# Altium schematic sheet RTC.SchDoc
size A4; DocumentNumber: 7; SheetNumber: 7; SheetTotal: 7
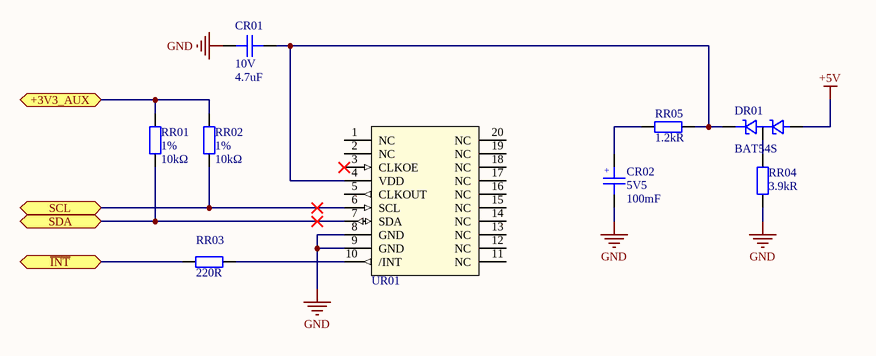
[diagram p0: RTC.SchDoc]

## Parts
CR01  Voltage Rating: 10V  Capacitance: 4.7uF  [0603C]  (hidden comment: CAP CER 4.7UF 10V X5R 0603)
CR02  Voltage Rating: 5V5  Capacitance: 100mF  [WCAP-ASLI_5x5.5]  (hidden comment: CAP ALUM 100 UF 20% 6.3 V SMD)
DR01  BAT54S
RR01  Tolerance: 1%  Resistance: 10kΩ  [R0603]  (hidden comment: 10 kOhms ±1% 0.1W, 1/10W Chip Resistor 0603 (1608 Metric)  Thick Film)
RR02  Tolerance: 1%  Resistance: 10kΩ  [R0603]  (hidden comment: 10 kOhms ±1% 0.1W, 1/10W Chip Resistor 0603 (1608 Metric)  Thick Film)
RR03  Resistance: 220R  [Resistor-0603]  (hidden comment: R 220Ω ±1% 0603 0.1W)
RR04  Resistance: 3.9kR  [Resistor-0603]  (hidden comment: R 3kΩ ±1% 0603 0.1W)
RR05  Resistance: 1.2kR  [R0402]  (hidden comment: RES SMD 1.2K OHM 1% 1/16W 0402)
UR01  IC RTC-8564JE RTC CLK/CALENDAR I2C 20-VSOJ  (value not drawn)

## Ports
+3V3_AUX, SCL, SDA, ~{INT}

## Nets
+5V: DR01.1
GND: CR01.2 CR02.2 RR04.2 UR01.8(GND) UR01.9(GND)
+3V3_AUX: RR01.2 RR02.2 ; port +3V3_AUX
~{INT}: RR03.1 ; port ~{INT}
SCL: RR02.1 UR01.6(SCL) ; port SCL
SDA: RR01.1 UR01.7(SDA) ; port SDA
NetCR01_1: CR01.1 DR01.2 RR05.1 UR01.4(VDD)
NetCR02_1: CR02.1 RR05.2
NetDR01_3: DR01.3 RR04.1
NetRR03_2: RR03.2 UR01.10(/INT)

Not connected (* = marked no-connect by the designer): UR01 1(NC) 2(NC) 3(CLKOE)* 5(CLKOUT) 11(NC) 12(NC) 13(NC) 14(NC) 15(NC) 16(NC) 17(NC) 18(NC) 19(NC) 20(NC)

## Notes on the sheet
- Title
- Size:
- Date:
- A4
- Number:
- Time:
- Revision:
- Sheet
- of
- File:
- (in symbol CAP ALUM 100 UF 20% 6.3 V SMD) +

## Library data of the parts
CR01 = CAP CER 4.7UF 10V X5R 0603: 4.7µF ±10% 10V Ceramic Capacitor X5R 0603 (1608 Metric); Manufacturer: Yageo; Manufacturer Part Number: CC0603KRX5R6BB475; Supplier 1: Digi-Key; Stock 1: 325858; Pricing 1: 1=0.26, 10=0.18, 100=0.102, 500=0.072, 1000=0.063 (USD); Mount: Surface Mount; Case Code (Imperial): 0603; Case Code (Metric): 1608; Min Operating Temperature: -55°C; Max Operating Temperature: 85°C; Voltage Rating (DC): 10V; Tolerance: 10%; Packaging: Tape and Reel; Package Quantity: 1; Dielectric: X5R; Termination: SMD/SMT; Composition: Ceramic; Length: 1.6mm; Height: 0.8mm; Width: 0.8mm; Thickness: 0.035inch; Depth: 0.8mm; Radiation Hardening: No; REACH SVHC: Unknown; Lead Free: Lead Free; Halogen Free: Halogen Free; ComponentLink1URL: http://www.farnell.com/datasheets/2167237.pdf?src-supplier=Element14; ComponentLink1Description: http://www.farnell.com/datasheets/2167237.pdf?src-supplier=Element14; ComponentLink2URL: http://www.yageo.com/documents/recent/UPY-GPHC_X5R_4V-to-50V_25.pdf?src-supplier=Digi-Key; ComponentLink2Description: http://www.yageo.com/documents/recent/UPY-GPHC_X5R_4V-to-50V_25.pdf?src-supplier=Digi-Key; ComponentLink3URL: http://www.yageo.com/documents/recent/UPY-GPHC_X5R_4V-to-50V_12.pdf?src-supplier=Avnet; ComponentLink3Description: http://www.yageo.com/documents/recent/UPY-GPHC_X5R_4V-to-50V_12.pdf?src-supplier=Avnet; ComponentLink4URL: http://www.yageo.com/documents/recent/UPY-GPHC_X5R_4V-to-50V_12.pdf?src-supplier=Avnet+Europe; ComponentLink4Description: http://www.yageo.com/documents/recent/UPY-GPHC_X5R_4V-to-50V_12.pdf?src-supplier=Avnet+Europe; Supplier Part Number 1: 311-1455-1-ND; Case/Package: 0603
CR02 = CAP ALUM 100 UF 20% 6.3 V SMD: 100µF 6.3V Aluminum Electrolytic Capacitors Radial, Can - SMD  2000 Hrs @ 105°C; Manufacturer Part Number: 865080142007; Manufacturer: Wurth Elektronik; Dissipation Factor: 24%; Endurance: 2000h; Leakage Current: 6.3uA; Ripple Current: 170mA; Capacitance Tolerance: +/-20%; Technical Reference: ASEC055101M6R3DVCTBB000; Polarity: Polar; Impedance: 800mR; Life (Hours): 2000Hour; ComponentLink1Description: Manufacturer; ComponentLink1URL: http://www.we-online.de; ComponentLink2Description: Datasheet; ComponentLink2URL: https://www.we-online.com/catalog/datasheet/865080142007.pdf; Height: 5.5mm; Mounting Technology: SMT; Operating Temperature: -55 to +105degC; Packaging: Tape and Reel; Published Date: May 2020; Diameter: 5mm; Supplier 1: Digi-Key; Stock 1: 2227; Pricing 1: 1=0.2, 50=0.167, 100=0.145, 250=0.129, 500=0.113 (USD); Mount: Surface Mount; Case/Package: Radial; Min Operating Temperature: -55°C; Max Operating Temperature: 105°C; Package Quantity: 1000; Ripple Current (AC): 170mA; Tolerance: 20%; Voltage Rating (DC): 6.3V; Height - Seated (Max): 0.217inch; REACH SVHC: Unknown; ComponentLink3URL: http://www.farnell.com/datasheets/1880090.pdf?src-supplier=Farnell; ComponentLink3Description: http://www.farnell.com/datasheets/1880090.pdf?src-supplier=Farnell; ComponentLink4URL: http://www.farnell.com/datasheets/1880090.pdf?src-supplier=Newark; ComponentLink4Description: http://www.farnell.com/datasheets/1880090.pdf?src-supplier=Newark; ComponentLink5URL: http://katalog.we-online.de/pbs/datasheet/865080142007.pdf?src-supplier=Digi-Key; ComponentLink5Description: http://katalog.we-online.de/pbs/datasheet/865080142007.pdf?src-supplier=Digi-Key; ComponentLink6URL: http://www.farnell.com/datasheets/1880090.pdf?src-supplier=Element14; ComponentLink6Description: http://www.farnell.com/datasheets/1880090.pdf?src-supplier=Element14; ComponentLink7URL: https://katalog.we-online.de/pbs/datasheet/865080142007.pdf?src-supplier=Digi-Key; ComponentLink7Description: https://katalog.we-online.de/pbs/datasheet/865080142007.pdf?src-supplier=Digi-Key; Supplier Part Number 1: 732-8472-1-ND
DR01 = BAT54S: Schottky DiodeS
RR01 RR02 = RES SMD 10K OHM 1% 1/10W 0603: Manufacturer: Yageo; Manufacturer Part Number: RC0603FR-0710KL; Temperature Coefficient: 100ppm/°C; Power Rating: 100mW; Voltage Rating: 75V; Voltage Rating (DC): 50V; Supplier 1: Digi-Key; Stock 1: 81498627; Pricing 1: 1=0.1, 10=0.024, 100=0.0097, 1000=0.0044, 2500=0.0038 (USD); Case Code (Imperial): 0603; Case Code (Metric): 1608; Min Operating Temperature: -55°C; Max Operating Temperature: 155°C; Composition: Thick Film; Packaging: Tape and Reel; Termination: SMD/SMT; Military Standard: Not; Length: 1.6mm; Height: 0.45mm; Depth: 0.8mm; REACH SVHC: No SVHC; Lead Free: Lead Free; ComponentLink1URL: http://www.farnell.com/datasheets/38590.pdf?src-supplier=Element14; ComponentLink1Description: http://www.farnell.com/datasheets/38590.pdf?src-supplier=Element14; ComponentLink2URL: https://www.verical.com/server-webapp/html/getDatasheet?partID=409289&src-supplier=Verical; ComponentLink2Description: https://www.verical.com/server-webapp/html/getDatasheet?partID=409289&src-supplier=Verical; ComponentLink3URL: http://www.farnell.com/datasheets/1868787.pdf?src-supplier=Element14; ComponentLink3Description: http://www.farnell.com/datasheets/1868787.pdf?src-supplier=Element14; ComponentLink4URL: http://www.farnell.com/datasheets/2167052.pdf?src-supplier=Element14; ComponentLink4Description: http://www.farnell.com/datasheets/2167052.pdf?src-supplier=Element14; ComponentLink5URL: http://www.farnell.com/datasheets/443971.pdf?src-supplier=Element14; ComponentLink5Description: http://www.farnell.com/datasheets/443971.pdf?src-supplier=Element14; Supplier Part Number 1: 311-10.0KHRCT-ND; Case/Package: 0603; Number of Pins: 2; Weight: 7.1E-05oz; Width: 0.8mm; Lead Pitch: 0.3mm
RR03 = R 220Ω ±1% 0603 0.1W: Resistor; Manufacturer: Stackpole Electronics; Manufacturer Part Number: RMCF0603FT220R; Power Rating: 100mW; Temperature Coefficient: 100ppm/°C; Supplier 1: Digi-Key; Stock 1: 79747; Pricing 1: 1=0.1, 10=0.016, 100=0.0065, 1000=0.0029, 2500=0.0025 (USD); Mount: Surface Mount; Case/Package: 0603; Case Code (Metric): 1608; Case Code (Imperial): 0603; Contact Plating: Tin,Matte; Min Operating Temperature: -55°C; Max Operating Temperature: 155°C; Packaging: Tape and Reel; Composition: Thick Film; Number of Terminations: 2; Max Power Dissipation: 100mW; Features: Automotive AEC-Q200; Length: 0.061inch; Height: 0.022inch; Width: 0.031inch; Radiation Hardening: No; Lead Free: Lead Free; ComponentLink1URL: http://components.arrow.com/part/dataview/50498833S229663N1174?src-supplier=Arrow; ComponentLink1Description: http://components.arrow.com/part/dataview/50498833S229663N1174?src-supplier=Arrow; ComponentLink2URL: https://www.seielect.com/catalog/SEI-Packaging.pdf?src-supplier=Digi-Key; ComponentLink2Description: https://www.seielect.com/catalog/SEI-Packaging.pdf?src-supplier=Digi-Key; ComponentLink3URL: http://www.seielect.com/Catalog/SEI-RMC.pdf?src-supplier=Future+Electronics; ComponentLink3Description: http://www.seielect.com/Catalog/SEI-RMC.pdf?src-supplier=Future+Electronics; ComponentLink4URL: https://www.seielect.com/catalog/SEI-RMCF_RMCP.pdf?src-supplier=Avnet; ComponentLink4Description: https://www.seielect.com/catalog/SEI-RMCF_RMCP.pdf?src-supplier=Avnet; Supplier Part Number 1: RMCF0603FT220RCT-ND; Tolerance: 1%
RR04 = R 3kΩ ±1% 0603 0.1W: Resistor; Manufacturer: Yageo; Manufacturer Part Number: RC0603FR-073KL; Temperature Coefficient: 100ppm/°C; Power Rating: 100mW; Voltage Rating: 50V; Supplier 1: Digi-Key; Stock 1: 3150938; Pricing 1: 1=0.1, 10=0.024, 100=0.0097, 1000=0.0044, 2500=0.0038 (USD); Case/Package: 0603; Number of Pins: 2; Case Code (Imperial): 0603; Case Code (Metric): 1608; Min Operating Temperature: -55°C; Max Operating Temperature: 155°C; Packaging: Tape and Reel; Composition: Thick Film; Termination: SMD/SMT; Voltage Rating (DC): 50V; Military Standard: Not; Length: 1.6mm; Width: 800um; Depth: 0.8mm; Lead Free: Lead Free; REACH SVHC: No SVHC; Supplier Part Number 1: 311-3.00KHRCT-ND; Tolerance: 1%
RR05 = RES SMD 1.2K OHM 1% 1/16W 0402: 1.2 kOhms ±1% 0.063W, 1/16W Chip Resistor 0402 (1005 Metric) Moisture Resistant Thick Film; Manufacturer: Yageo; Manufacturer Part Number: RC0402FR-071K2L; Power Rating: 63mW; Voltage Rating: 50V; Temperature Coefficient: 100ppm/°C; Supplier 1: Digi-Key; Stock 1: 894472; Pricing 1: 1=0.1, 10=0.015, 100=0.0062, 1000=0.0028, 2500=0.0024, 5000=0.002 (USD); Case/Package: 0402; Case Code (Imperial): 0402; Case Code (Metric): 1005; Min Operating Temperature: -55°C; Max Operating Temperature: 155°C; Packaging: Tape and Reel; Package Quantity: 1; Termination: SMD/SMT; Composition: Thick Film; Number of Terminations: 2; Military Standard: Not; Max Power Dissipation: 63mW; Features: Moisture Resistant; Length: 1mm; Height: 0.016inch; Width: 0.02inch; Depth: 0.5mm; REACH SVHC: Unknown; Lead Free: Lead Free; ComponentLink1URL: http://www.farnell.com/datasheets/2167052.pdf?src-supplier=Element14; ComponentLink1Description: http://www.farnell.com/datasheets/2167052.pdf?src-supplier=Element14; ComponentLink2URL: https://www.verical.com/server-webapp/html/getDatasheet?partID=323716&src-supplier=Verical; ComponentLink2Description: https://www.verical.com/server-webapp/html/getDatasheet?partID=323716&src-supplier=Verical; ComponentLink3URL: http://documents.rs-components.com/techlib://itc_doclist_GB.htm?stockno=6186138&src-supplier=RSComponents; ComponentLink3Description: http://documents.rs-components.com/techlib://itc_doclist_GB.htm?stockno=6186138&src-supplier=RSComponents; ComponentLink4URL: http://www.yageo.com/documents/recent/PYu-RC_Group_51_RoHS_L_10.pdf?src-supplier=Digi-Key; ComponentLink4Description: http://www.yageo.com/documents/recent/PYu-RC_Group_51_RoHS_L_10.pdf?src-supplier=Digi-Key; ComponentLink5URL: http://www.yageo.com/documents/recent/PYu-RC_Group_51_RoHS_L_9.pdf?src-supplier=Digi-Key; ComponentLink5Description: http://www.yageo.com/documents/recent/PYu-RC_Group_51_RoHS_L_9.pdf?src-supplier=Digi-Key; ComponentLink6URL: http://www.yageo.com/documents/recent/PYu-RC0402_51_RoHS_L_6_r.pdf?src-supplier=Future+Electronics; ComponentLink6Description: http://www.yageo.com/documents/recent/PYu-RC0402_51_RoHS_L_6_r.pdf?src-supplier=Future+Electronics; Supplier Part Number 1: 311-1.20KLRCT-ND; Tolerance: 1%